# Altium schematic sheet pca10112_sheet8_FEM.SchDoc: PCA10112 - Front End Module
size A3; Organization: Nordic Semiconductor; DocumentNumber: 8; Revision: 1.1.0; SheetNumber: 8; SheetTotal: 8; CompanyName: Nordic Semiconductor; DrawnBy: HANY; ProjectName: pca10112.PrjPCB
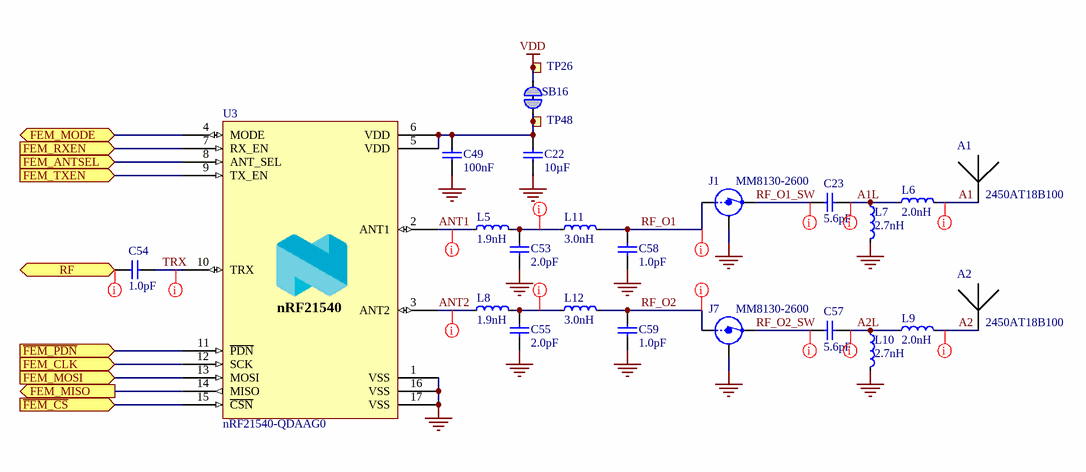
[diagram p0: pca10112_sheet8_FEM.SchDoc]

## Parts
A1  2450AT18B100  [2450AT18B100]
A2  2450AT18B100  [2450AT18B100]
C22  10µF  [CAPC1608X06L]
C23  5.6pF  [CAPC0603X03L_C]
C49  100nF  [CAPC0603X03L_C]
C53  2.0pF  [CAPC0603X03L_C]
C54  1.0pF  [CAPC0603X03L_C]
C55  2.0pF  [CAPC0603X03L_C]
C57  5.6pF  [CAPC0603X03L_C]
C58  1.0pF  [CAPC0603X03L_C]
C59  1.0pF  [CAPC0603X03L_C]
J1  MM8130-2600  [COAXIAL-SWF]
J7  MM8130-2600  [COAXIAL-SWF]
L5  1.9nH  [INDC0603X03L_C]
L6  2.0nH  [INDC0603X03L_C]
L7  2.7nH  [INDC0603X03L_C]
L8  1.9nH  [INDC0603X03L_C]
L9  2.0nH  [INDC0603X03L_C]
L10  2.7nH  [INDC0603X03L_C]
L11  3.0nH  [INDC0603X03L_C]
L12  3.0nH  [INDC0603X03L_C]
SB16  Solderbridge  [Solderbridge_Shorted]  (value not drawn)  (net tie, no BOM)
TP26  Ø1.0mm,SMD  [TP_SMD_Ø1.0mm]  (value not drawn)  (no BOM)
TP48  Ø1.0mm,SMD  [TP_SMD_Ø1.0mm]  (value not drawn)  (no BOM)
U3  nRF21540-QDAAG0  [QFN65P400X400X65_HS-17N]

## Ports
FEM_ANTSEL (in), FEM_CLK (in), FEM_MISO (out), FEM_MODE (bidir), FEM_MOSI (in), FEM_RXEN (in), FEM_TXEN (in), RF (bidir), ~{FEM_CS} (in), ~{FEM_PDN} (in)

## Nets
GND: C22.1 C49.1 C53.1 C55.1 C58.1 C59.1 J1.2(Shield) J7.2(Shield) L7.2 L10.2 U3.1(VSS) U3.16(VSS) U3.17(VSS)
VDD: SB16.1 TP26.1
A1: A1.1 L6.2
A1L: C23.1 L6.1 L7.1
A2: A2.1 L9.2
A2L: C57.1 L9.1 L10.1
ANT1: L5.1 U3.2(ANT1)
ANT2: L8.1 U3.3(ANT2)
~{FEM_CS}: U3.15(~{CSN}) ; port ~{FEM_CS}
~{FEM_PDN}: U3.11(~{PDN}) ; port ~{FEM_PDN}
FEM_ANTSEL: U3.8(ANT_SEL) ; port FEM_ANTSEL
FEM_CLK: U3.12(SCK) ; port FEM_CLK
FEM_MISO: U3.14(MISO) ; port FEM_MISO
FEM_MODE: U3.4(MODE) ; port FEM_MODE
FEM_MOSI: U3.13(MOSI) ; port FEM_MOSI
FEM_RXEN: U3.7(RX_EN) ; port FEM_RXEN
FEM_TXEN: U3.9(TX_EN) ; port FEM_TXEN
RF: C54.1 ; port RF
RF_O1: C58.2 J1.1(IN) L11.2
RF_O1_SW: C23.2 J1.3(OUT)
RF_O2: C59.2 J7.1(IN) L12.2
RF_O2_SW: C57.2 J7.3(OUT)
TRX: C54.2 U3.10(TRX)
NetC22_2: C22.2 C49.2 SB16.2 TP48.1 U3.5(VDD) U3.6(VDD)
NetC53_2: C53.2 L5.2 L11.1
NetC55_2: C55.2 L8.2 L12.1

## Layout directives
net class Ant: A1, A1L, A2, A2L, ANT1, ANT2, NetC53_2, NetC55_2, RF, RF_O1, RF_O1_SW, RF_O2, RF_O2_SW, TRX

## Notes on the sheet
- Size
- Date:
- A3
- Project Number
- Sheet         of
- Revision
- File:
- Drawn By:
- (in symbol nRF21540-QDAAG0) nRF21540

## Library data of the parts
A1 A2 = Johanson 2450AT18B100: 2.45 GHz chip antenna; Manufacturer: Johanson Technology; Part number IPS: 00000007781; Note: N.A.; Pad Count: 2; Part Number: Johanson 2450AT18B100; Manufacturer Part Number: 2450AT18B100; Footprint Doc: 2450AT18B100; LatestRevisionDate: 2013-09-13; Pin Count: 2; Publisher: Nordic Semiconductor; Published: 2013-09-13; Value: 2450AT18B100; Artikkelnr Noca: N.A.; ComponentLink1URL: N.A.; ComponentLink1Description: Datasheet; ComponentLink2URL: N.A.; ComponentLink2Description: Supplier link; HelpURL: http://www.johansontechnology.com/datasheets/antennas/2450AT18B100.pdf; Supplier 1: Digi-Key; Supplier Part Number 1: 712-1006-1-ND; Supplier 2: N.A.; Supplier Part Number 2: N.A.; Component Class: Antennas; PartId: 100700001; Author: rsk; Part number Norautron: N.A.
C22 = C0603-10µ: Capacitor, X5R, ±20%; Manufacturer: N.A.; Part number IPS: 00000007785; Note: 6.3V; Artikkelnr Noca: 20039234; Pad Count: 2; Part Number: C0603-10µ; Manufacturer Part Number: N.A.; ComponentLink1URL: N.A.; ComponentLink1Description: Datasheet; ComponentLink2URL: N.A.; ComponentLink2Description: Supplier link; HelpURL: N.A.; Footprint Doc: 0603; LatestRevisionDate: 2011-01-17; Pin Count: 2; Publisher: Nordic Semiconductor; Published: 2011-01-17; Value: 10µF; Supplier 1: N.A.; Supplier Part Number 1: N.A.; Supplier 2: N.A.; Supplier Part Number 2: N.A.; Component Class: Capacitors; PartId: 100200275; Author: rsk; Part number Norautron: N.A.
C23 C57 = C0201-5.6p: Chip Cap 0201; Manufacturer: N.A.; Part number IPS: 00000004899; Note: Chip Cap 1%; Pad Count: 2; Part Number: C0201-5.6p; Manufacturer Part Number: N.A.; LatestRevisionDate: 2020-10-13; Pin Count: 2; Publisher: Nordic Semiconductor; Published: 2014-11-13; Value: 5.6pF; Artikkelnr Noca: N.A.; Footprint Doc: 0201; ComponentLink1URL: N.A.; ComponentLink1Description: Datasheet; ComponentLink2URL: N.A.; ComponentLink2Description: Supplier link; HelpURL: N.A.; Supplier 1: N.A.; Supplier Part Number 1: N.A.; Supplier 2: N.A.; Supplier Part Number 2: N.A.; Component Class: Capacitors; PartId: 100200028; Author: rsk; Part number Norautron: N.A.
C49 = C0201-100n: Capacitor, X5R, ±10%; Manufacturer: N.A.; Part number IPS: 00000001248, 00000002505; Note: 16V; Pad Count: 2; Part Number: C0201-100n; Manufacturer Part Number: N.A.; ComponentLink1URL: N.A.; ComponentLink1Description: Datasheet; ComponentLink2URL: N.A.; ComponentLink2Description: Supplier link; HelpURL: N.A.; Footprint Doc: 0201; LatestRevisionDate: 2017-11-09; Pin Count: 2; Publisher: Nordic Semiconductor; Published: 2014-11-13; Value: 100nF; Artikkelnr Noca: N.A.; Supplier 1: N.A.; Supplier Part Number 1: N.A.; Supplier 2: N.A.; Supplier Part Number 2: N.A.; Component Class: Capacitors; PartId: 100200078; Author: rsk; Part number Norautron: N.A.
C53 C55 = C0201-2.0p-HQ-Murata: Capacitor, NP0, ±0.05pF, 25V; Manufacturer: Murata; Manufacturer Part Number: GJM0335C1E2R0WB01; Part number IPS: 00000001775; Artikkelnr Noca: N.A.; Pad Count: 2; Part Number: C0201-2.0p-HQ-Murata; ComponentLink1URL: N.A.; ComponentLink1Description: Datasheet; ComponentLink2URL: N.A.; ComponentLink2Description: Supplier link; HelpURL: https://psearch.en.murata.com/capacitor/product/GJM0335C1E2R0WB01%23.html; Footprint Doc: 0201; LatestRevisionDate: 2018-10-25; Published: 2018-10-25; Value: 2.0pF; Note: 25V; Supplier 1: N.A.; Supplier Part Number 1: N.A.; Supplier 2: N.A.; Supplier Part Number 2: N.A.; Component Class: Capacitors; PartId: 100200419; Author: rsk; Part number Norautron: N.A.
C54 = C0201-1p0: CAP CER 1PF 25V C0G/NP0 0201; Manufacturer: Murata; Manufacturer Part Number: GJM0335C1E1R0BB01D; Part number IPS: 00000007964; Note: ±0.1pF; Artikkelnr Noca: N.A.; Pad Count: 2; Part Number: C0201-1p0; ComponentLink1URL: N.A.; ComponentLink1Description: Datasheet; ComponentLink2Description: Supplier link; HelpURL: http://search.murata.co.jp/Ceramy/image/img/A01X/G101/ENG/GJM0335C1E1R0BB01-01.pdf; Footprint Doc: 0201; LatestRevisionDate: 2020-10-13; Pin Count: 2; Publisher: Nordic Semiconductor; Published: 2017-09-21; Value: 1.0pF; ComponentLink2URL: N.A.; Supplier 1: Digi-Key; Supplier Part Number 1: 490-11172-1-ND; Supplier 2: N.A.; Supplier Part Number 2: N.A.; Component Class: Capacitors; PartId: 100200398; Author: rsk; Part number Norautron: N.A.
C58 C59 = C0201-1.0p_RF: RF Chip Cap 0201; Manufacturer: N.A.; Note: High frequency chip capasitors ±5%, NP0; Pad Count: 2; Part Number: C0201-1.0p_RF; Manufacturer Part Number: N.A.; ComponentLink1URL: N.A.; ComponentLink1Description: Datasheet; ComponentLink2URL: N.A.; ComponentLink2Description: Supplier link; HelpURL: N.A.; Footprint Doc: 0201; LatestRevisionDate: 2016-04-22; Published: 2016-04-22; Value: 1.0pF; Artikkelnr Noca: N.A.; Part number IPS: N.A.; Supplier 1: N.A.; Supplier Part Number 1: N.A.; Supplier 2: N.A.; Supplier Part Number 2: N.A.; Component Class: Capacitors; PartId: 100200085; Author: rsk; Part number Norautron: N.A.
J1 J7 = MM8130-2600: Coaxial Connector with Switch; Manufacturer: Murata; Part number IPS: 00000009955; Note: N.A.; Artikkelnr Noca: 55029011; Pad Count: 3; Part Number: MM8130-2600; Manufacturer Part Number: MM8130-2600; LatestRevisionDate: 2014-04-24; Pin Count: 3; Publisher: Nordic Semiconductor; Published: 2014-04-24; Value: MM8130-2600; Footprint Doc: COAXIAL-SWF; ComponentLink1URL: N.A.; ComponentLink1Description: Datasheet; ComponentLink2URL: N.A.; ComponentLink2Description: Supplier link; HelpURL: http://www.murata.com/products/catalog/pdf/o33e.pdf; Supplier 1: Digi-Key; Supplier Part Number 1: 490-4981-1-ND; Supplier 2: Mouser; Supplier Part Number 2: 81-MM8130-2600RA2; Component Class: Connectors; PartId: 100500400; Author: rsk; Part number Norautron: N.A.
L5 L8 = L0201-1n9-HQ-Murata: Inductor, 600mA, ±0.1ｎH, 120mOhm; Manufacturer: Murata; Manufacturer Part Number: LQP03HQ1N9B02; Part number IPS: 00000004903; Note: -55°C ~ 125°C; Artikkelnr Noca: N.A.; Pad Count: 2; Part Number: L0201-1n9-HQ-Murata; ComponentLink1URL: https://search.murata.co.jp/Ceramy/image/img/P02/JELF243C-0021.pdf; ComponentLink1Description: Datasheet; ComponentLink2Description: Supplier link; HelpURL: https://psearch.en.murata.com/inductor/product/LQP03HQ1N9B02%23.html; Footprint Doc: 0201; LatestRevisionDate: 2018-10-23; Pin Count: 2; Publisher: Nordic Semiconductor; Published: 2018-10-23; Value: 1.9nH; ComponentLink2URL: N.A.; Supplier 1: Digi-Key; Supplier Part Number 1: 490-13889-1-ND; Supplier 2: N.A.; Supplier Part Number 2: N.A.; Component Class: Inductors; PartId: 100300206; Author: rsk; Part number Norautron: N.A.
L6 L9 = L0201-2n0-HQ-Murata: Inductor, 600mA, ±0.1ｎH, 120mOhm; Manufacturer: Murata; Manufacturer Part Number: LQP03HQ2N0B02; Part number IPS: 00000001670; Note: -55°C ~ 125°C; Artikkelnr Noca: N.A.; Pad Count: 2; Part Number: L0201-2n0-HQ-Murata; LatestRevisionDate: 2018-10-23; Pin Count: 2; Publisher: Nordic Semiconductor; Published: 2018-10-23; Value: 2.0nH; Footprint Doc: 0201; ComponentLink1Description: Datasheet; ComponentLink2Description: Supplier link; ComponentLink1URL: https://search.murata.co.jp/Ceramy/image/img/P02/JELF243C-0021.pdf; HelpURL: https://psearch.en.murata.com/inductor/product/LQP03HQ2N0B02%23.html; ComponentLink2URL: N.A.; Supplier 1: Digi-Key; Supplier Part Number 1: 490-13895-1-ND; Supplier 2: N.A.; Supplier Part Number 2: N.A.; Component Class: Inductors; PartId: 100300207; Author: rsk; Part number Norautron: N.A.
L7 L10 = L0201-2n7-HQ-Murata: Inductor, 600mA, ±0.1ｎH, 120mOhm; Manufacturer: Murata; Manufacturer Part Number: LQP03HQ2N7B02; Part number IPS: 00000001753; Note: -55°C ~ 125°C; Artikkelnr Noca: N.A.; Pad Count: 2; Part Number: L0201-2n7-HQ-Murata; LatestRevisionDate: 2018-10-23; Pin Count: 2; Publisher: Nordic Semiconductor; Published: 2018-10-23; Value: 2.7nH; Footprint Doc: 0201; ComponentLink1Description: Datasheet; ComponentLink2Description: Supplier link; ComponentLink1URL: https://search.murata.co.jp/Ceramy/image/img/P02/JELF243C-0021.pdf; HelpURL: https://psearch.en.murata.com/inductor/product/LQP03HQ2N7B02%23.html; ComponentLink2URL: N.A.; Supplier 1: Digi-Key; Supplier Part Number 1: 490-13909-1-ND; Supplier 2: N.A.; Supplier Part Number 2: N.A.; Component Class: Inductors; PartId: 100300214; Author: rsk; Part number Norautron: N.A.
L11 L12 = L0201-3n0-HQ-Murata: Inductor, 600mA, ±0.1ｎH, 120mOhm; Manufacturer: Murata; Manufacturer Part Number: LQP03HQ3N0B02; Note: -55°C ~ 125°C; Artikkelnr Noca: N.A.; Pad Count: 2; Part Number: L0201-3n0-HQ-Murata; ComponentLink1URL: https://search.murata.co.jp/Ceramy/image/img/P02/JELF243C-0021.pdf; ComponentLink1Description: Datasheet; ComponentLink2Description: Supplier link; HelpURL: https://psearch.en.murata.com/inductor/product/LQP03HQ3N0B02%23.html; Footprint Doc: 0201; LatestRevisionDate: 2018-10-23; Published: 2018-10-23; Value: 3.0nH; Part number IPS: N.A.; ComponentLink2URL: N.A.; Supplier 1: Digi-Key; Supplier Part Number 1: 490-13915-1-ND; Supplier 2: N.A.; Supplier Part Number 2: N.A.; Component Class: Inductors; PartId: 100300217; Author: rsk; Part number Norautron: N.A.
SB16 = Solderbridge Shorted: Shorted Solderbridge; Manufacturer: N.A.; Pad Count: 2; Part Number: Solderbridge Shorted; Manufacturer Part Number: N.A.; LatestRevisionDate: 2012-08-07; Pin Count: 2; Publisher: Nordic Semiconductor; Published: 2012-08-07; Value: Solderbridge; Note: N.A.; Artikkelnr Noca: N.A.; Footprint Doc: Solderbridge_Shorted; Part number IPS: N.A.; ComponentLink1URL: N.A.; ComponentLink1Description: Datasheet; ComponentLink2URL: N.A.; ComponentLink2Description: Supplier link; HelpURL: N.A.; Supplier 1: N.A.; Supplier Part Number 1: N.A.; Supplier 2: N.A.; Supplier Part Number 2: N.A.; Component Class: Connectors; PartId: 100500459; Author: rsk; Part number Norautron: N.A.
TP26 TP48 = TP_SMD_Ø1.0MM: 1.0mm circular SMD testpad; Manufacturer: Nordic Semiconductor; Manufacturer Part Number: N.A.; Pad Count: 1; Part Number: TP_SMD_Ø1.0MM; LatestRevisionDate: 2021-03-05; Pin Count: 1; Publisher: Nordic Semiconductor; Published: 2013-06-11; Value: Ø1.0mm,SMD; Note: N.A.; Artikkelnr Noca: N.A.; Footprint Doc: TP_SMD_Ø1.0mm; Part number IPS: N.A.; ComponentLink1URL: N.A.; ComponentLink1Description: Datasheet; ComponentLink2URL: N.A.; ComponentLink2Description: Supplier link; HelpURL: N.A.; Supplier 1: N.A.; Supplier Part Number 1: N.A.; Supplier 2: N.A.; Supplier Part Number 2: N.A.; Component Class: Connectors; PartId: 100500475; Author: rsk; Part number Norautron: N.A.
U3 = nRF21540-QDAAG0: Radio front-end / range extender for 2.4GHz; Manufacturer: Nordic Semiconductor; Artikkelnr Noca: N.A.; Pad Count: 16; Author: hany; Component Class: nRF_Devices; ComponentLink1Description: Datasheet; ComponentLink1URL: N.A.; ComponentLink2Description: Supplier link; ComponentLink2URL: N.A.; Footprint Doc: QFN-16; HelpURL: N.A.; LatestRevisionDate: 2021-03-24; Manufacturer Part Number: nRF21540-QDAAG0; Note: N.A.; Part number IPS: N.A.; Part number Norautron: N.A.; Published: 2021-03-24; Supplier 1: Nordic Semiconductor; Supplier 2: N.A.; Supplier Part Number 1: nRF21540-QDAAG0; Supplier Part Number 2: N.A.; Value: nRF21540-QDAAG0; Part Number: nRF21540-QDAAG0